# Altium schematic sheet PM3_Bosclone_MCU_2.SchDoc
size 282 x 200 mm
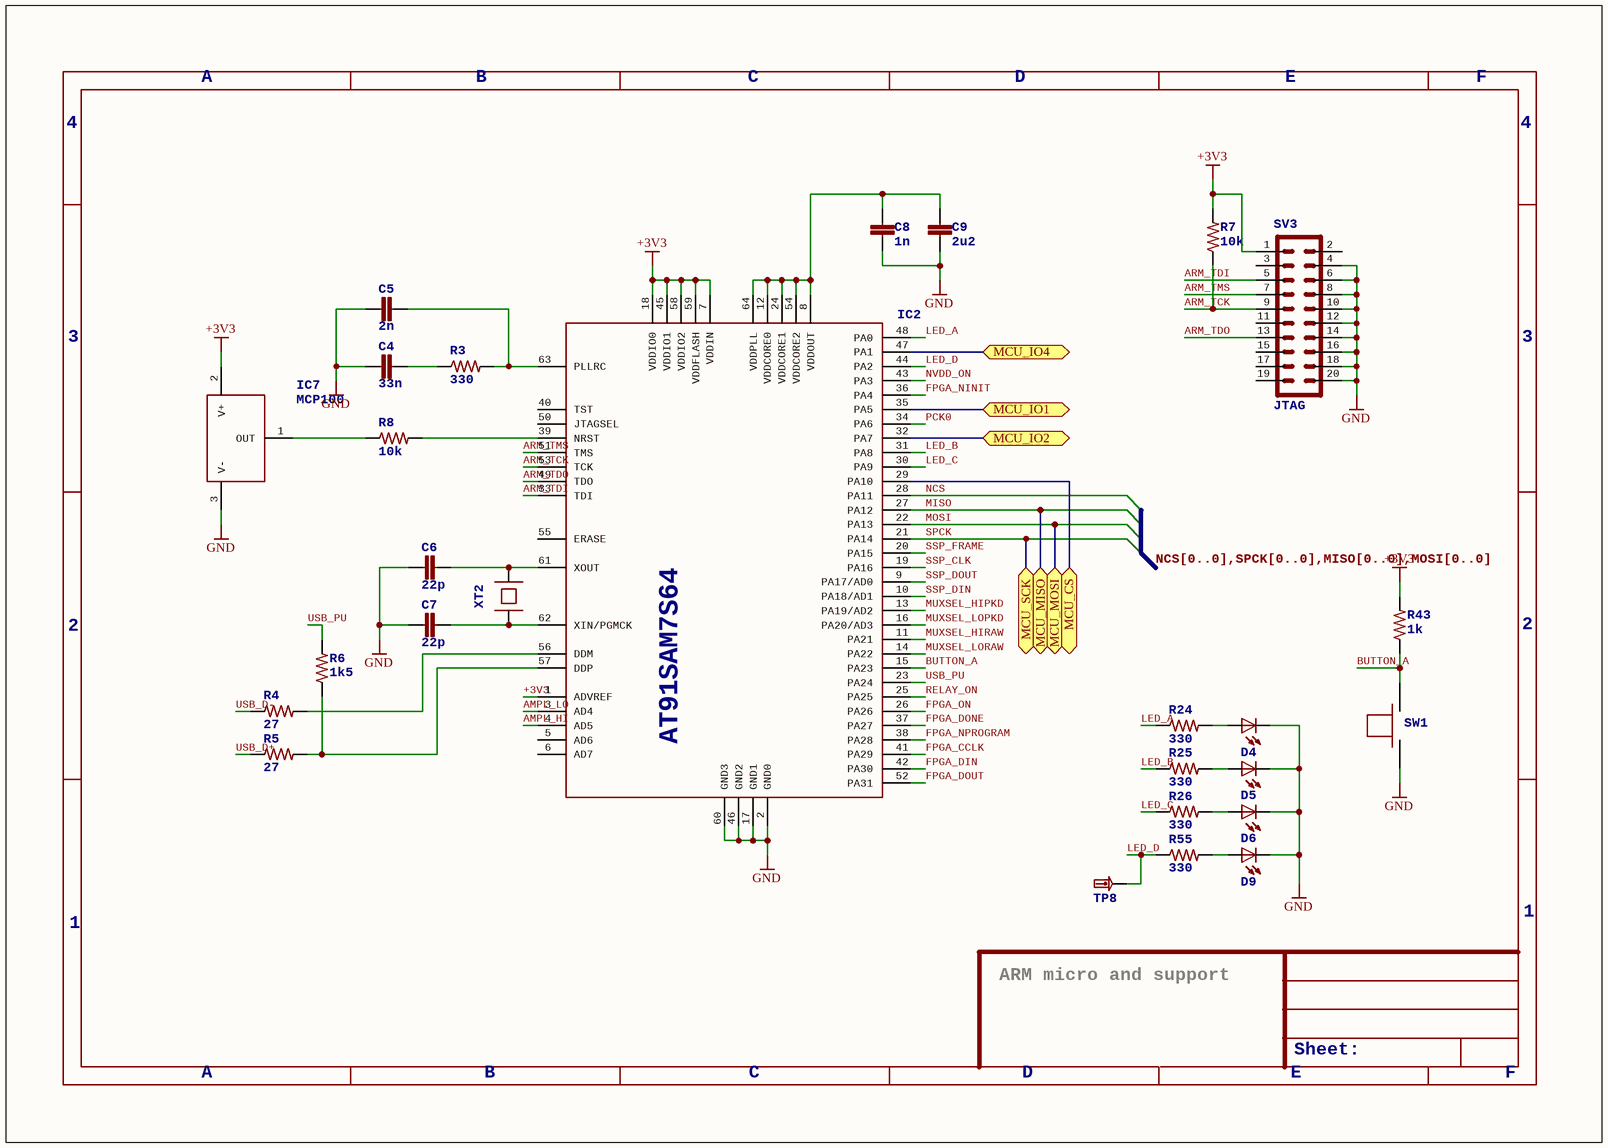
[diagram p0: PM3_Bosclone_MCU_2.SchDoc]

## Parts
C4  33n  [RLC_0603]
C5  2n  [RLC_0603]
C6  22p  [RLC_0603]
C7  22p  [RLC_0603]
C8  1n  [RLC_0603]
C9  2u2  [RLC_1210]
D4  LED  [LED_0603]  (value not drawn)
D5  LED  [LED_0603]  (value not drawn)
D6  LED  [LED_0603]  (value not drawn)
D9  LED  [LED_0603]  (value not drawn)
IC2  AT91SAM7S64  [LQFP-64]
IC7  MCP100  [SOT23-3LEAD]
R3  330  [RLC_0603]
R4  27  [RLC_0603]
R5  27  [RLC_0603]
R6  1k5  [RLC_0603]
R7  10k  [RLC_0603]
R8  10k  [RLC_0603]
R24  330  [RLC_0603]
R25  330  [RLC_0603]
R26  330  [RLC_0603]
R43  1k  [RLC_0603]
R55  330  [RLC_0603]
SV3  JTAG  [HEADER-MALE-10X2-0.100-SHROUDED]
SW1  TACTSWITCH  [TACTSWITCH-SMD-EVQQ1]  (value not drawn)
TP8  TESTPADKEYSTONE-SMD  [KEYSTONE-SMD-TESTPOINT-5015]  (value not drawn)
XT2  XTAL-SMD-CITIZEN-CS10  [XTAL-SMD-CITIZEN-CS10]  (value not drawn)

## Ports
MCU_CS, MCU_IO1, MCU_IO2, MCU_IO4, MCU_MISO, MCU_MOSI, MCU_SCK

## Nets
+3V3: IC2.1(ADVREF) IC2.7(VDDIN) IC2.18(VDDIO0) IC2.45(VDDIO1) IC2.58(VDDIO2) IC2.59(VDDFLASH) IC7.2(V+) R7.2 R43.2 SV3.1
GND: C4.1 C5.1 C6.1 C7.1 C8.2 C9.2 D4.-(C) D5.-(C) D6.-(C) D9.-(C) IC2.2(GND0) IC2.17(GND1) IC2.46(GND2) IC2.60(GND3) IC7.3(V-) SV3.4 SV3.6 SV3.8 SV3.10 SV3.12 SV3.14 SV3.16 SV3.18 SV3.20 SW1.A(P$1)
AMPL_HI: IC2.4(AD5)
AMPL_LO: IC2.3(AD4)
ARM_TCK: IC2.53(TCK) R7.1 SV3.9
ARM_TDI: IC2.33(TDI) SV3.5
ARM_TDO: IC2.49(TDO) SV3.13
ARM_TMS: IC2.51(TMS) SV3.7
BUTTON_A: IC2.15(PA23) R43.1 SW1.B(P$2)
FPGA_CCLK: IC2.41(PA29)
FPGA_DIN: IC2.42(PA30)
FPGA_DONE: IC2.37(PA27)
FPGA_DOUT: IC2.52(PA31)
FPGA_NINIT: IC2.36(PA4)
FPGA_NPROGRAM: IC2.38(PA28)
FPGA_ON: IC2.26(PA26)
LED_A: IC2.48(PA0) R24.1
LED_B: IC2.31(PA8) R25.1
LED_C: IC2.30(PA9) R26.1
LED_D: IC2.44(PA2) R55.1 TP8.1(P$1)
MCU_CS: IC2.29(PA10) ; port MCU_CS
MCU_IO1: IC2.35(PA5) ; port MCU_IO1
MCU_IO2: IC2.32(PA7) ; port MCU_IO2
MCU_IO4: IC2.47(PA1) ; port MCU_IO4
MISO: IC2.27(PA12) ; port MCU_MISO
MOSI: IC2.22(PA13) ; port MCU_MOSI
MUXSEL_HIPKD: IC2.13(PA19/AD2)
MUXSEL_HIRAW: IC2.11(PA21)
MUXSEL_LOPKD: IC2.16(PA20/AD3)
MUXSEL_LORAW: IC2.14(PA22)
NCS: IC2.28(PA11)
NVDD_ON: IC2.43(PA3)
PCK0: IC2.34(PA6)
RELAY_ON: IC2.25(PA25)
SPCK: IC2.21(PA14) ; port MCU_SCK
SSP_CLK: IC2.19(PA16)
SSP_DIN: IC2.10(PA18/AD1)
SSP_DOUT: IC2.9(PA17/AD0)
SSP_FRAME: IC2.20(PA15)
USB_D+: R5.1
USB_D-: R4.1
USB_PU: IC2.23(PA24) R6.2
NetC4_2: C4.2 R3.1
NetC5_2: C5.2 IC2.63(PLLRC) R3.2
NetC6_2: C6.2 IC2.61(XOUT) XT2.B
NetC7_2: C7.2 IC2.62(XIN/PGMCK) XT2.A
NetC8_1: C8.1 C9.1 IC2.8(VDDOUT) IC2.12(VDDCORE0) IC2.24(VDDCORE1) IC2.54(VDDCORE2) IC2.64(VDDPLL)
NetD4_+: D4.+(A) R24.2
NetD5_+: D5.+(A) R25.2
NetD6_+: D6.+(A) R26.2
NetD9_+: D9.+(A) R55.2
NetIC2_39: IC2.39(NRST) R8.2
NetIC2_56: IC2.56(DDM) R4.2
NetIC2_57: IC2.57(DDP) R5.2 R6.1
NetIC7_1: IC7.1(OUT) R8.1

Not connected (* = marked no-connect by the designer): IC2 5(AD6) 6(AD7) 40(TST) 50(JTAGSEL) 55(ERASE); SV3 2 3 11 15 17 19

## Buses and harness runs
bus NCS[0..0],SPCK[0..0],MISO[0..0],MOSI[0..0]

## Notes on the sheet
- A
- B
- C
- D
- E
- F
- 4
- 3
- 2
- 1
- ARM micro and support
- Sheet:

## Library data of the parts
C4-C8 = CAPACITOR0603
C9 = CAPACITOR1210
R3-R8 R24-R26 R43 R55 = RESISTOR0603
SV3 = HEADER-MALE-10X2
IC2 = AT91SAM7S64: AT91SAM7S64: AT91SAM7S64